# Altium schematic sheet 20_AI_Board.SchDoc
size 420 x 297 mm; SheetNumber: 33; SheetTotal: 35
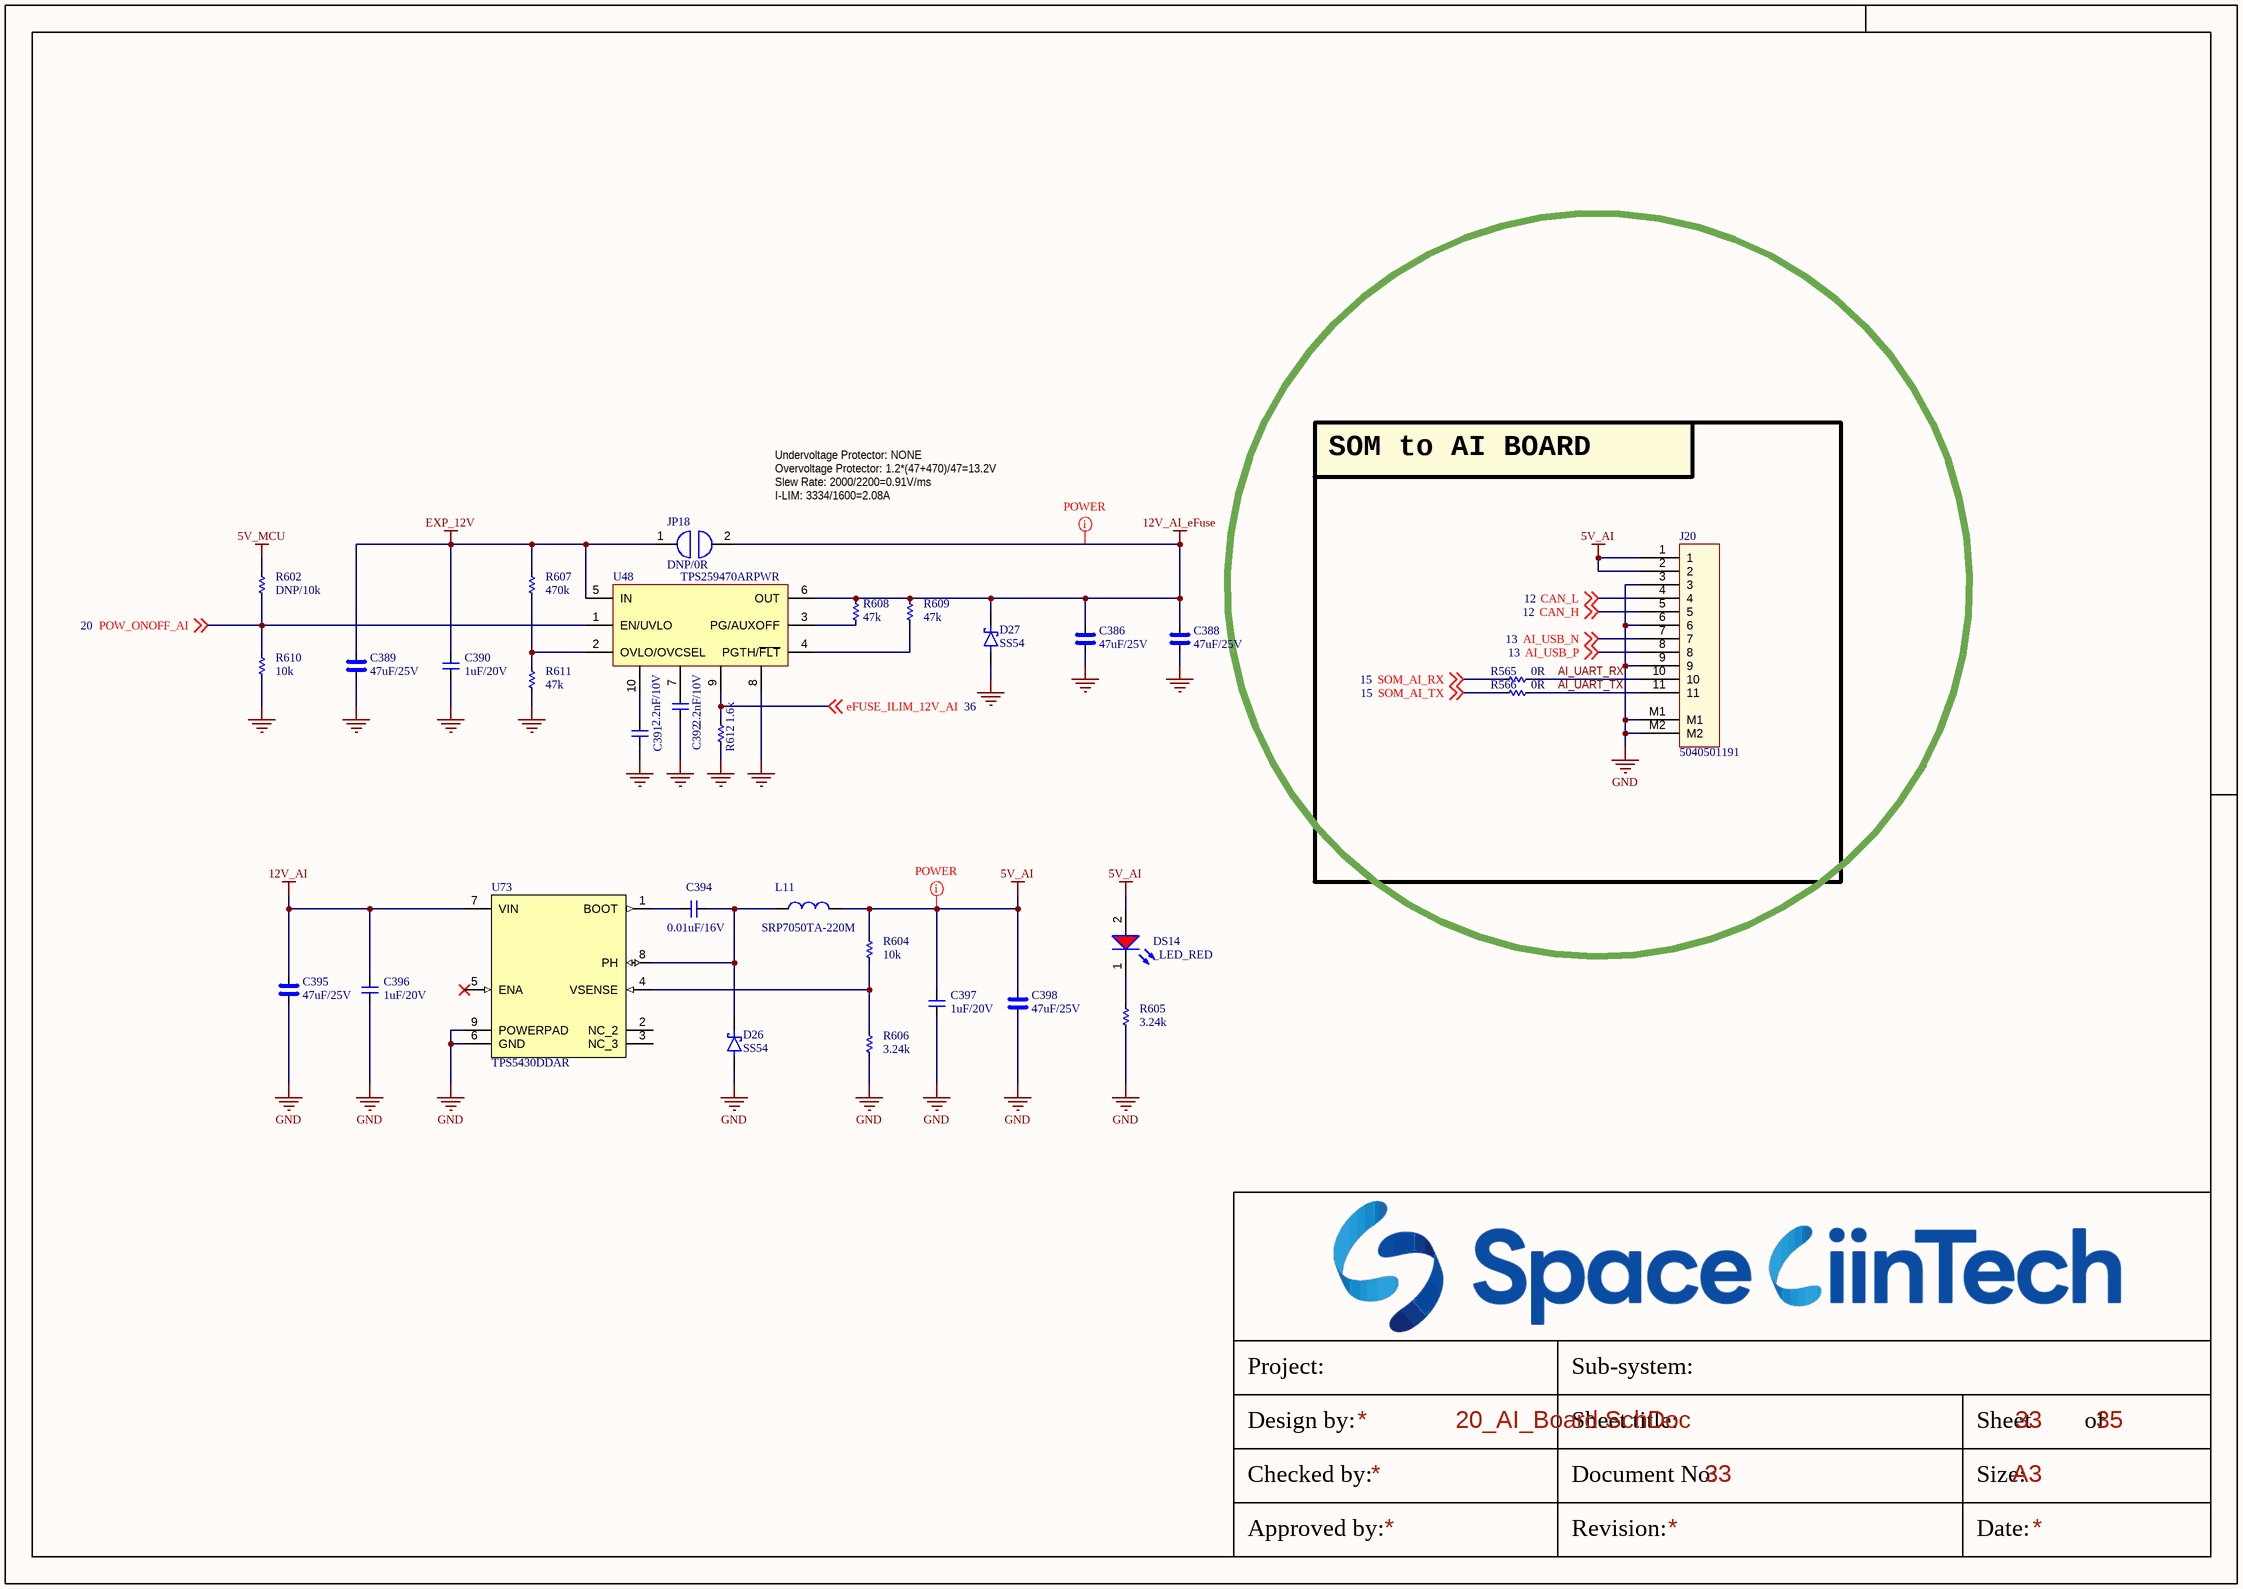
[diagram p0: 20_AI_Board.SchDoc]

## Parts
C386  47uF/25V  [CAP_C_3225X80]
C388  47uF/25V  [CAP_C_3225X80]
C389  47uF/25V  [CAP_C_3225X80]
C390  1uF/20V  [CAP_C_1005X60]
C391  2.2nF/10V  [CAP_C_1005X60]
C392  2.2nF/10V  [CAP_C_1005X60]
C394  0.01uF/16V  [CAP_C_1608X80]
C395  47uF/25V  [CAP_C_3225X80]
C396  1uF/20V  [CAP_C_1005X60]
C397  1uF/20V  [CAP_C_1005X60]
C398  47uF/25V  [CAP_C_3225X80]
D26  SS54  [DO-214AC_SMA]
D27  SS54  [DO-214AC_SMA]
DS14  _LED_RED  [LED_0603]
J20  5040501191  [MOLEX_5040501191]
JP18  DNP/0R  [JUMPER_1608]
L11  SRP7050TA-220M  [PSM6050]
R565  0R  [RES_C_1005X40]
R566  0R  [RES_C_1005X40]
R602  DNP/10k  [RES_C_1005X40]
R604  10k  [RES_C_1005X40]
R605  3.24k  [RES_C_1005X40]
R606  3.24k  [RES_C_1005X40]
R607  470k  [RES_C_1005X40]
R608  47k  [RES_C_1005X40]
R609  47k  [RES_C_1005X40]
R610  10k  [RES_C_1005X40]
R611  47k  [RES_C_1005X40]
R612  1.6k  [RES_C_1005X40]
U48  TPS259470ARPWR  [VQFN-HR-10]
U73  TPS5430DDAR  [TPS54531DDAR]

## Blocks framed on the sheet
SOM to AI BOARD: J20 R565 R566

## Nets
5V_AI: C397.2 C398.2 DS14.2(A) J20.1 J20.2 L11.2 R604.2
5V_MCU: R602.1
12V_AI: C395.2 C396.2 U73.7(VIN)
12V_AI_eFuse: C386.2 C388.2 D27.1(K) JP18.2 R608.2 R609.2 U48.6(OUT)
EXP_12V: C389.2 C390.2 JP18.1 R607.2 U48.5(IN)
GND: C386.1 C388.1 C389.1 C390.1 C391.1 C392.1 C395.1 C396.1 C397.1 C398.1 D26.2(A) D27.2(A) J20.3 J20.6 J20.9 J20.M1 J20.M2 R605.1 R606.1 R610.2 R611.1 R612.1 U48.8 U73.6(GND) U73.9(POWERPAD)
AI_UART_RX: J20.10 R565.2
AI_UART_TX: J20.11 R566.2
AI_USB_N: J20.7 ; off-sheet AI_USB_N
AI_USB_P: J20.8 ; off-sheet AI_USB_P
CAN_H: J20.5 ; off-sheet CAN_H
CAN_L: J20.4 ; off-sheet CAN_L
eFUSE_ILIM_12V_AI: R612.2 U48.9 ; off-sheet eFUSE_ILIM_12V_AI
POW_ONOFF_AI: R602.2 R610.1 U48.1(EN/UVLO) ; off-sheet POW_ONOFF_AI
SOM_AI_RX: R565.1 ; off-sheet SOM_AI_RX
SOM_AI_TX: R566.1 ; off-sheet SOM_AI_TX
NetC391_2: C391.2 U48.10
NetC392_2: C392.2 U48.7
NetC394_1: C394.1 D26.1(K) L11.1 U73.8(PH)
NetC394_2: C394.2 U73.1(BOOT)
NetDS14_1: DS14.1(K) R605.2
NetR604_1: R604.1 R606.2 U73.4(VSENSE)
NetR607_1: R607.1 R611.2 U48.2(OVLO/OVCSEL)
NetR608_1: R608.1 U48.3(PG/AUXOFF)
NetR609_1: R609.1 U48.4(PGTH/~{FLT})

Not connected (* = marked no-connect by the designer): U73 2(NC_2) 3(NC_3) 5(ENA)*

## Layout directives
net class POWER: 5V_AI, 12V_AI_eFuse

## Notes on the sheet
- Undervoltage Protector: NONE
- Overvoltage Protector: 1.2*(47+470)/47=13.2V
- Slew Rate: 2000/2200=0.91V/ms
- I-LIM: 3334/1600=2.08A
- Project:
- Sub-system:
- Design by:
- Sheet title:
- Sheet
- of
- Checked by:
- Approved by:
- Revision:
- Document No:
- Size:
- Date:
- A3

## Library data of the parts
C386 C388 C389 C395 C398 = _CAP_C_High_2: CAP High Value
C390-C392 C394 C396 C397 = _CAP_C_2: CAP
D26 D27 = DIODE SCHOTTKY
J20 = Header 11x1_2M
JP18 = JUMPER
L11 = SRP7050TA-220M: FIXED IND 22UH 2.5A 170 MOHM SMD
R565 R566 R602 R604-R612 = _RES_B_2: RES
U73 = TPS5430DDAR: IC REG BUCK ADJ 3A 8SOPWR